# EAGLE design ADE7753_Breakout (EAGLE 6.3)
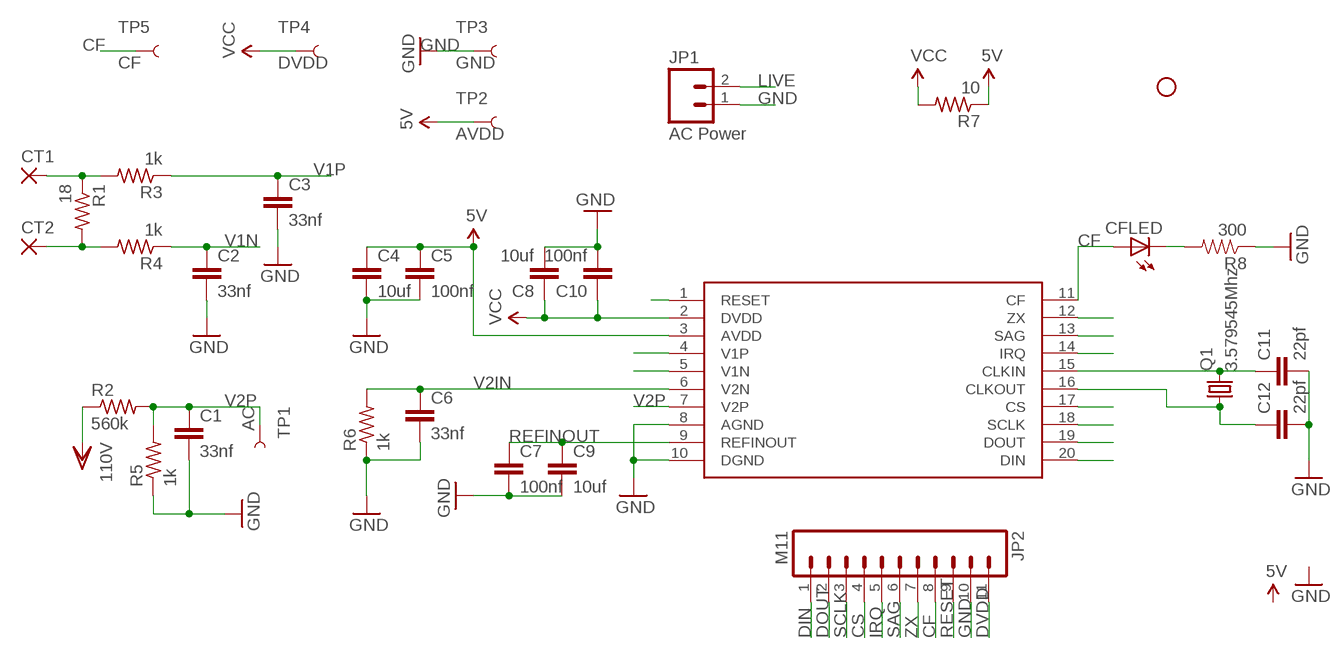
[diagram p0: schematic, sheet 1]

## Parts
C1  33nf  CAP0805  [0805]
C2  33nf  CAP0805  [0805]
C3  33nf  CAP0805  [0805]
C4  10uf  CAP0805  [0805]
C5  100nf  CAP0805  [0805]
C6  33nf  CAP0805  [0805]
C7  100nf  CAP0805  [0805]
C8  10uf  CAP0805  [0805]
C9  10uf  CAP0805  [0805]
C10  100nf  CAP0805  [0805]
C11  22pf  CAP0805  [0805]
C12  22pf  CAP0805  [0805]
CFLED  LEDCHIP-LED0805  [CHIP-LED0805]
CT1  2,54/1,0  [2,54/1,0]
CT2  2,54/1,0  [2,54/1,0]
JP1  AC Power  M025MM  [SCREWTERMINAL-5MM-2]
JP2  M11  M11LOCK  [1X11_LOCK]
JP3  STAND-OFF  [STAND-OFF]
Q1  3.579545Mhz  CRYSTALSMD  [HC49UP]
R1  18  R-US_R0805  [R0805]
R2  560k  R-US_R0805  [R0805]
R3  1k  R-US_R0805  [R0805]
R4  1k  R-US_R0805  [R0805]
R5  1k  R-US_R0805  [R0805]
R6  1k  R-US_R0805  [R0805]
R7  10  R-US_R0805  [R0805]
R8  300  RESISTOR  [0805]
TP1  AC  TEST-POINT3  [PAD.03X.03]
TP2  AVDD  TEST-POINT3  [PAD.03X.03]
TP3  GND  TEST-POINT3  [PAD.03X.03]
TP4  DVDD  TEST-POINT3  [PAD.03X.03]
TP5  CF  TEST-POINT3  [PAD.03X.03]
U1  ADE7753  [SSOP20]

## Nets
AVDD [5v_2]: C4.1 C5.1 R7.1 TP2.P$1 U1.3(AVDD) ; supply symbol labelled 5V
CF: CFLED.A JP2.8 TP5.P$1 U1.11(CF)
CLKIN: C11.1 Q1.2 U1.15(CLKIN)
CLKOUT: C12.1 Q1.1 U1.16(CLKOUT)
CS: JP2.4 U1.17(CS)
DIN: JP2.1 U1.20(DIN)
DOUT: JP2.2 U1.19(DOUT)
DVDD [5v]: C8.1 C10.1 JP2.11 R7.2 TP4.P$1 U1.2(DVDD) ; supply symbol labelled VCC
GND [gnd]: C1.2 C2.2 C3.2 C4.2 C5.2 C6.2 C7.2 C8.2 C9.2 C10.2 C11.2 C12.2 JP1.1 JP2.10 R5.1 R6.1 R8.1 TP3.P$1 U1.8(AGND) U1.10(DGND)
IRQ: JP2.5 U1.14(IRQ)
LIVE [acpower]: JP1.2 R2.1 ; supply symbol labelled 110V
N$1: CT1.1(P) R1.1 R3.2
N$2: CT2.1(P) R1.2 R4.2
N$27: CFLED.C R8.2
REFINOUT: C7.1 C9.1 U1.9(REFINOUT)
RESET: JP2.9 U1.1(RESET)
SAG: JP2.6 U1.13(SAG)
SCLK: JP2.3 U1.18(SCLK)
V1N: C2.1 R4.1 U1.5(V1N)
V1P: C3.1 R3.1 U1.4(V1P)
V2IN: C6.1 R6.2 U1.6(V2N)
V2P: C1.1 R2.2 R5.2 TP1.P$1 U1.7(V2P)
ZX: JP2.7 U1.12(ZX)

## Library data of the parts
C1-C12 = SparkFun-Passives:CAP: Capacitor Standard 0603 ceramic capacitor, and 0.1" leaded capacitor.
CFLED = led:LED: LED OSRAM: - CHIPLED LG R971, LG N971, LY N971, LG Q971, LY Q971, LO R971, LY R971 LH N974, LH R974 LS Q976, LO Q976, LY Q976 LO Q996 - Hyper CHIPLED LW Q18S LB Q993, LB Q99A, LB R99A - SideLED LS A670, LO A670, LY A670, LG A670, LP A670 LB A673, LV A673, LT A673, LW A673 LH A674 LY A675 LS A676, LA A676, LO A676, LY A676, LW A676 LS A679, LY A679, LG A679 - Hyper Micro SIDELED® LS Y876, LA Y876, LO Y876, LY Y876 LT Y87S - SmartLED LW L88C, LW L88S LB L89C, LB L89S, LG L890 LS L89K, LO L89K, LY L89K LS L896, LA L896, LO L896, LY L896 - TOPLED LS T670, LO T670, LY T670, LG T670, LP T670 LSG T670, LSP T670, LSY T670, LOP T670, LYG T670 LG T671, LOG T671, LSG T671 LB T673, LV T673, LT T673, LW T673 LH T674 LS T676, LA T676, LO T676, LY T676, LB T676, LH T676, LSB T676, LW T676 LB T67C, LV T67C, LT T67C, LS T67K, LO T67K, LY T67K, LW E67C LS E67B, LA E67B, LO E67B, LY E67B, LB E67C, LV E67C, LT E67C LW T67C LS T679, LY T679, LG T679 LS T770, LO T770, LY T770, LG T770, LP T770 LB T773, LV T773, LT T773, LW T773 LH T774 LS E675, LA E675, LY E675, LS T675 LS T776, LA T776, LO T776, LY T776, LB T776 LHGB T686 LT T68C, LB T68C - Hyper Mini TOPLED® LB M676 - Mini TOPLED Santana® LG M470 LS M47K, LO M47K, LY M47K Source: http://www.osram.convergy.de LUXEON: - LUMILED® LXK2-PW12-R00, LXK2-PW12-S00, LXK2-PW14-U00, LXK2-PW14-V00 LXK2-PM12-R00, LXK2-PM12-S00, LXK2-PM14-U00 LXK2-PE12-Q00, LXK2-PE12-R00, LXK2-PE12-S00, LXK2-PE14-T00, LXK2-PE14-U00 LXK2-PB12-K00, LXK2-PB12-L00, LXK2-PB12-M00, LXK2-PB14-N00, LXK2-PB14-P00, LXK2-PB14-Q00 LXK2-PR12-L00, LXK2-PR12-M00, LXK2-PR14-Q00, LXK2-PR14-R00 LXK2-PD12-Q00, LXK2-PD12-R00, LXK2-PD12-S00 LXK2-PH12-R00, LXK2-PH12-S00 LXK2-PL12-P00, LXK2-PL12-Q00, LXK2-PL12-R00 Source: www.luxeon.com KINGBRIGHT: KA-3528ASYC Source: www.kingbright.com
CT1 CT2 = wirepad:2,54/1,0: THROUGH-HOLE PAD
JP1 = SparkFun-Connectors:M02: Header 2 Standard 2-pin 0.1" header. Use with straight break away headers (SKU : PRT-00116), right angle break away headers (PRT-00553), swiss pins (PRT-00743), machine pins (PRT-00117), and female headers (PRT-00115). Molex polarized connector foot print use with SKU : PRT-08233 with associated crimp pins and housings.
JP2 = SparkFun-Connectors:M11: Header 11 Standard 11-pin 0.1" header. Use with straight break away headers (SKU : PRT-00116), right angle break away headers (PRT-00553), swiss pins (PRT-00743), machine pins (PRT-00117), and female headers (PRT-00115).
JP3 = SparkFun-Electromechanical:STAND-OFF: #4 Stand Off This is the mechanical footprint for a #4 phillips button head screw. Use the keepout ring to avoid running the screw head into surrounding components. SKU : PRT-00447
Q1 = SparkFun-FreqCtrl:CRYSTAL: Various standard crystals. Proven footprints. Spark Fun Electronics SKU : COM-00534
R1-R7 = adafruit:R-US_: RESISTOR, American symbol
R8 = SparkFun:RESISTOR: Resistor Basic schematic elements and footprints for 0603, 1206, and PTH 1/10th watt (small) resistors.
TP1-TP5 = SparkFun-Passives:TEST-POINT: Bare copper test points for troubleshooting or ICT
U1 = ade7735:ADE7753

## Net classes
0 default: width 0.254 mm, drill 0.508 mm, clearance 0.254 mm
1 acpower: width 0.406 mm, drill 0.508 mm, clearance 0.762 mm
2 gnd: width 0.305 mm, drill 0.508 mm, clearance 0.254 mm
3 5v: width 0.254 mm, drill 0.508 mm, clearance 0.254 mm
4 5v_2: width 0.254 mm, drill 0.508 mm, clearance 0.254 mm

## Board
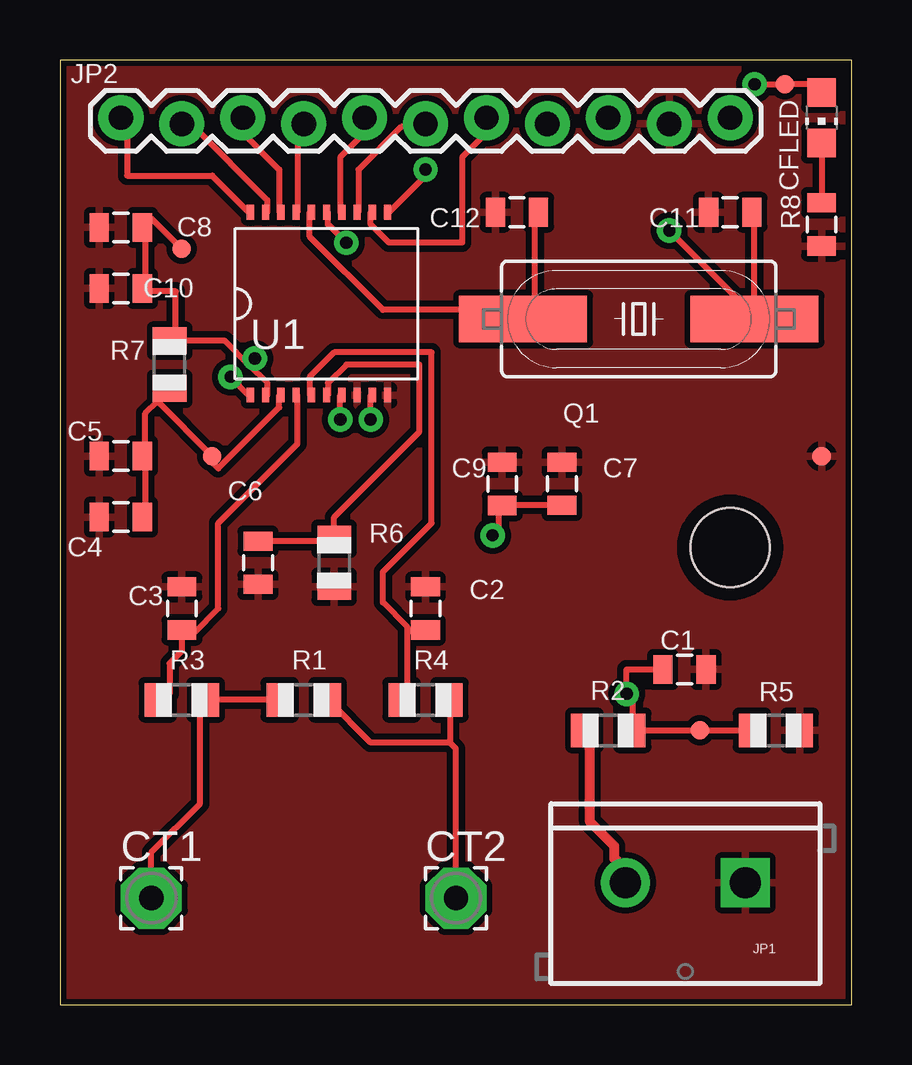
[diagram p1: board, top side]
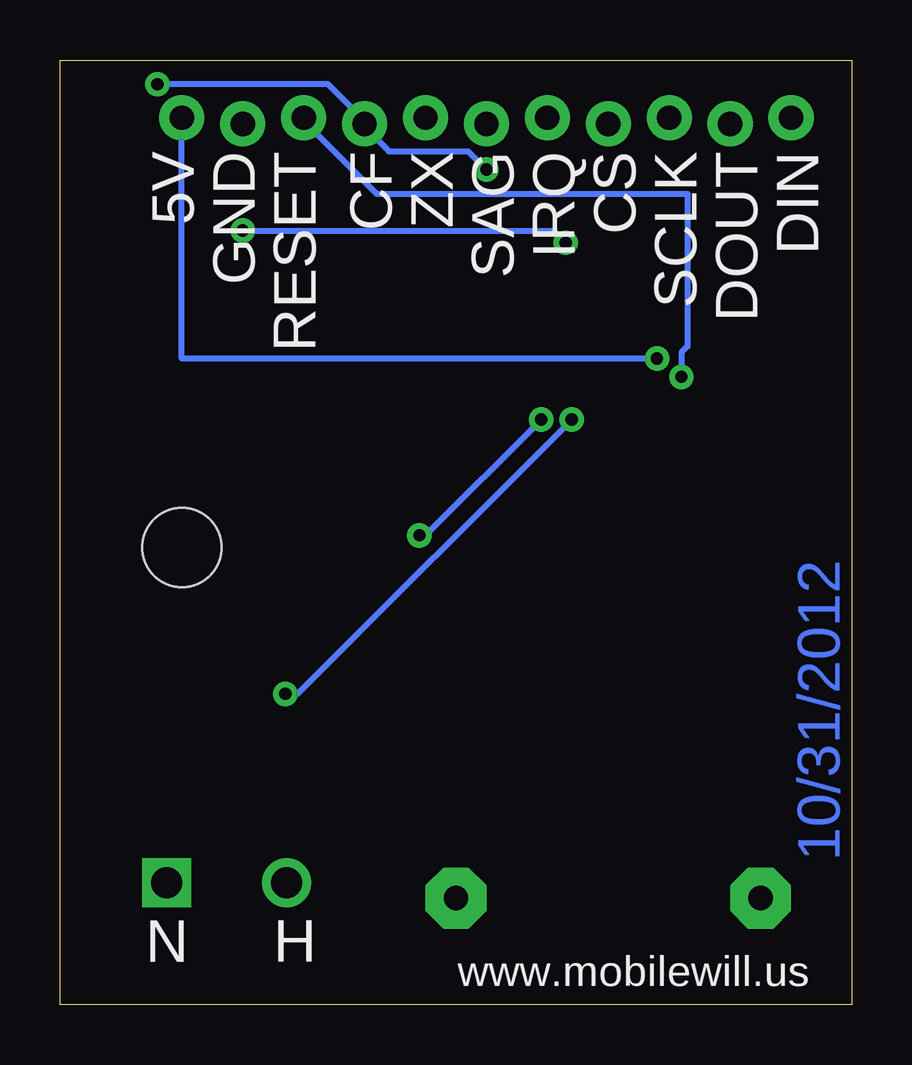
[diagram p2: board, bottom side, seen from below]

Size 33.02 x 39.36 mm. Coordinates in mm from the lower left corner, seen from the top.
Outline: 0,0 33.02,0 33.02,39.36 0,39.36 0,0
Copper layers (1*16): Top 0.035mm / dielectric 1.5mm / Bottom 0.035mm
Design rules "SparkFun": minimum track width 8mil, minimum drill 20mil, track to track 8mil, track to pad 8mil, pad to pad 8mil, via to via 8mil, smd to smd 8mil, copper to edge 10mil, drill to drill 8mil, minimum pad ring 12mil, minimum via ring 10mil, stop-mask expansion 4mil, vias tented up to drill 25mil, thermal gap 10mil

### Footprints (pad centres in the part's own frame; a part is rotated, then mirrored left to right if it is on the bottom)
0805 = smd 0.8 x 1.2: 1 -0.9,0; 2 0.9,0
CHIP-LED0805 = smd 1.2 x 1.2: A 0,-1.05; C 0,1.05
2,54/1,0 = drill 1.016 pad 2.54 octagon: 1 0,0
SCREWTERMINAL-5MM-2 = drill 1.3 pad 2.032 square: 1 0,0 | drill 1.3 pad 2.032: 2 5,0
1X11_LOCK = drill 1.016 pad 1.88: 1 0,0.127; 2 2.54,-0.127; 3 5.08,0.127; 4 7.62,-0.127; 5 10.16,0.127; 6 12.7,-0.127; 7 15.24,0.127; 8 17.78,-0.127; 9 20.32,0.127; 10 22.86,-0.127; 11 25.4,0.127
STAND-OFF = hole 3.302: 0,0
HC49UP = smd 5.334 x 1.93: 1 -4.826,0; 2 4.826,0
R0805 = smd 1.1 x 1.4: 1 -1,0; 2 1,0
PAD.03X.03 = smd 0.762 x 0.762: P$1 0,0
SSOP20 = smd 0.305 x 0.61: 1 -3.493,-3.81; 2 -2.857,-3.81; 3 -2.223,-3.81; 4 -1.587,-3.81; 5 -0.953,-3.81; 6 -0.318,-3.81; 7 0.318,-3.81; 8 0.953,-3.81; 9 1.587,-3.81; 10 2.223,-3.81; 11 2.223,3.81; 12 1.587,3.81; 13 0.953,3.81; 14 0.318,3.81; 15 -0.318,3.81; 16 -0.953,3.81; 17 -1.587,3.81; 18 -2.223,3.81; 19 -2.857,3.81; 20 -3.493,3.81

### Placement (x,y rotation side)
C1  26.04,13.97 0 top
C2  15.24,16.51 90 top
C3  5.08,16.51 90 top
C4  2.54,20.32 180 top
C5  2.54,22.86 180 top
C6  8.26,18.41 270 top
C7  20.93,21.71 90 top
C8  2.54,32.38 180 top
C9  18.44,21.7 90 top
C10  2.54,29.84 180 top
C11  27.94,33.02 180 top
C12  19.05,33.02 180 top
CFLED  31.75,36.96 180 top
CT1  3.81,4.45 0 top
CT2  16.51,4.45 0 top
JP1  28.57,5.08 180 top
JP2  2.54,36.83 0 top
JP3  27.94,19.05 0 top
Q1  24.13,28.57 0 top
R1  10.16,12.7 0 top
R2  22.86,11.43 0 top
R3  5.08,12.7 0 top
R4  15.24,12.7 0 top
R5  29.84,11.43 180 top
R6  11.43,18.41 90 top
R7  4.57,26.67 90 top
R8  31.75,32.51 90 top
TP1  26.67,11.43 0 top
TP2  6.35,22.86 0 top
TP3  31.75,22.86 0 top
TP4  5.08,31.5 0 top
TP5  30.23,38.35 0 top
U1  11.43,29.21 0 top

### Tracks (layer width: path | path; a pad name or v marks a point on that pad's centre or on a via)
AVDD
  Top 0.254: U1.3 9.14,25.4 9.14,24.89 6.6,22.35 6.35,22.61 TP2.P$1 4.06,25.15 | 3.56,22.86 3.56,20.32 C4.1 | 4.06,25.15 3.56,24.64 3.56,22.86 | 4.06,25.15 4.57,25.65 R7.1 4.06,25.15 | 3.56,22.86 C5.1
CF  (via drill 0.51)
  Top 0.254: CFLED.A 31.75,38.35 TP5.P$1 v28.96,38.35 | v15.24,34.8 15.24,34.54 13.72,33.02 U1.11
  Bottom 0.254: v15.24,34.8 16,35.56 19.3,35.56 20.32,36.58 JP2.8 20.32,36.83 21.84,38.35 v28.96,38.35
CLKIN  (via drill 0.51)
  Top 0.254: v11.94,31.75 11.18,32.51 11.18,33.02 U1.15 | 28.96,28.7 v25.4,32.26 | 28.96,28.7 28.96,33.02 C11.1 | 28.96,28.7 Q1.2
  Bottom 0.254: v11.94,31.75 12.45,32.26 v25.4,32.26
CLKOUT
  Top 0.254: 19.3,28.96 13.46,28.96 10.41,32 10.41,33.02 U1.16 | 19.3,28.96 Q1.1 19.3,28.7 | 19.3,28.96 19.81,29.46 19.81,33.02 C12.1
CS
  Top 0.254: U1.17 9.91,33.02 9.91,36.32 10.16,36.58 JP2.4
DIN
  Top 0.254: U1.20 7.87,33.02 6.35,34.54 2.79,34.54 2.79,36.58 2.54,36.83 JP2.1
DOUT
  Top 0.254: U1.19 8.64,33.02 8.64,33.53 5.59,36.58 5.08,36.58 JP2.2
DVDD  (via drill 0.51)
  Top 0.254: TP4.P$1 3.81,32.77 3.56,32.77 3.56,32.51 C8.1 3.56,32.26 3.56,29.97 C10.1 3.56,29.72 4.83,29.72 4.83,27.69 | 7.87,26.67 6.86,27.69 4.83,27.69 | 7.87,26.67 8.64,25.91 8.64,25.4 U1.2 | 4.83,27.69 4.57,27.69 R7.2 4.83,27.69 | 7.87,26.67 v8.13,26.92
  Bottom 0.254: JP2.11 27.94,26.92 v8.13,26.92
GND
  pour Top (isolate 0.254): 0,39.37 0,0 33.02,0 33.02,39.37
IRQ
  Top 0.254: JP2.5 12.7,36.32 11.68,35.31 11.68,33.02 U1.14
LIVE
  Top 0.406: R2.1 22.1,11.43 22.1,7.62 23.11,6.6 23.11,6.1 23.37,5.84 23.37,5.08 JP1.2
N$1
  Top 0.254: R1.1 R3.2 5.84,12.7 5.84,8.38 3.81,6.35 CT1.1
N$2
  Top 0.254: 16.26,10.92 12.95,10.92 11.18,12.7 R1.2 | 16.26,10.92 16.26,12.7 R4.2 | 16.26,10.92 16.51,10.67 CT2.1
N$27
  Top 0.254: CFLED.C R8.2
REFINOUT  (via drill 0.51)
  Top 0.254: v12.95,24.38 12.95,25.4 U1.9 | v18.03,19.56 18.29,19.81 18.29,20.57 C9.1 18.54,20.83 20.83,20.83 C7.1
  Bottom 0.254: v12.95,24.38 17.78,19.56 v18.03,19.56
RESET  (via drill 0.51)
  Top 0.254: v7.11,26.16 7.87,25.4 U1.1
  Bottom 0.254: v7.11,26.16 7.11,27.18 6.86,27.43 6.86,33.78 19.81,33.78 22.86,36.83 JP2.9
SAG
  Top 0.254: U1.13 12.45,33.02 12.45,34.8 14.22,36.58 15.24,36.58 JP2.6
SCLK
  Top 0.254: JP2.3 7.62,36.32 9.14,34.8 9.14,33.02 U1.18
V1N
  Top 0.254: 14.48,15.75 14.73,15.49 15.24,15.49 C2.1 | 14.48,15.75 13.46,16.76 13.46,18.03 15.49,20.07 15.49,27.18 11.43,27.18 10.41,26.16 10.41,25.4 U1.5 | 14.48,15.75 14.48,12.7 R4.1
V1P
  Top 0.254: 5.08,15.49 5.59,15.49 6.6,16.51 6.6,20.07 9.91,23.37 9.91,25.4 U1.4 | 5.08,15.49 5.08,14.73 4.57,14.22 4.57,12.95 4.32,12.7 R3.1 | 5.08,15.49 C3.1
V2IN
  Top 0.254: U1.6 11.18,25.4 11.18,25.91 11.94,26.67 14.99,26.67 14.99,23.88 11.43,20.32 R6.2 11.43,19.3 8.38,19.3 C6.1
V2P  (via drill 0.51)
  Top 0.254: v11.68,24.38 11.68,25.4 U1.7 | 23.88,11.43 23.88,12.7 v23.62,12.95 23.62,13.97 C1.1 | 23.88,11.43 TP1.P$1 R5.2 | 23.88,11.43 R2.2
  Bottom 0.254: v11.68,24.38 23.11,12.95 v23.62,12.95
ZX
  Top 0.254: JP2.7 17.78,36.32 16.76,35.31 16.76,31.75 13.72,31.75 12.95,32.51 12.95,33.02 U1.12

### Text on the board
Bottom: 10/31/2012
bPlace: DIN | DOUT | SCLK | CS | IRQ | SAG | ZX | CF | RESET | GND | 5V | www.mobilewill.us | H | N